# Altium schematic sheet 3V8_Power_Regulator.SchDoc: 3V8 Power Regulator
size 420 x 297 mm; SheetNumber: 3; SheetTotal: 9
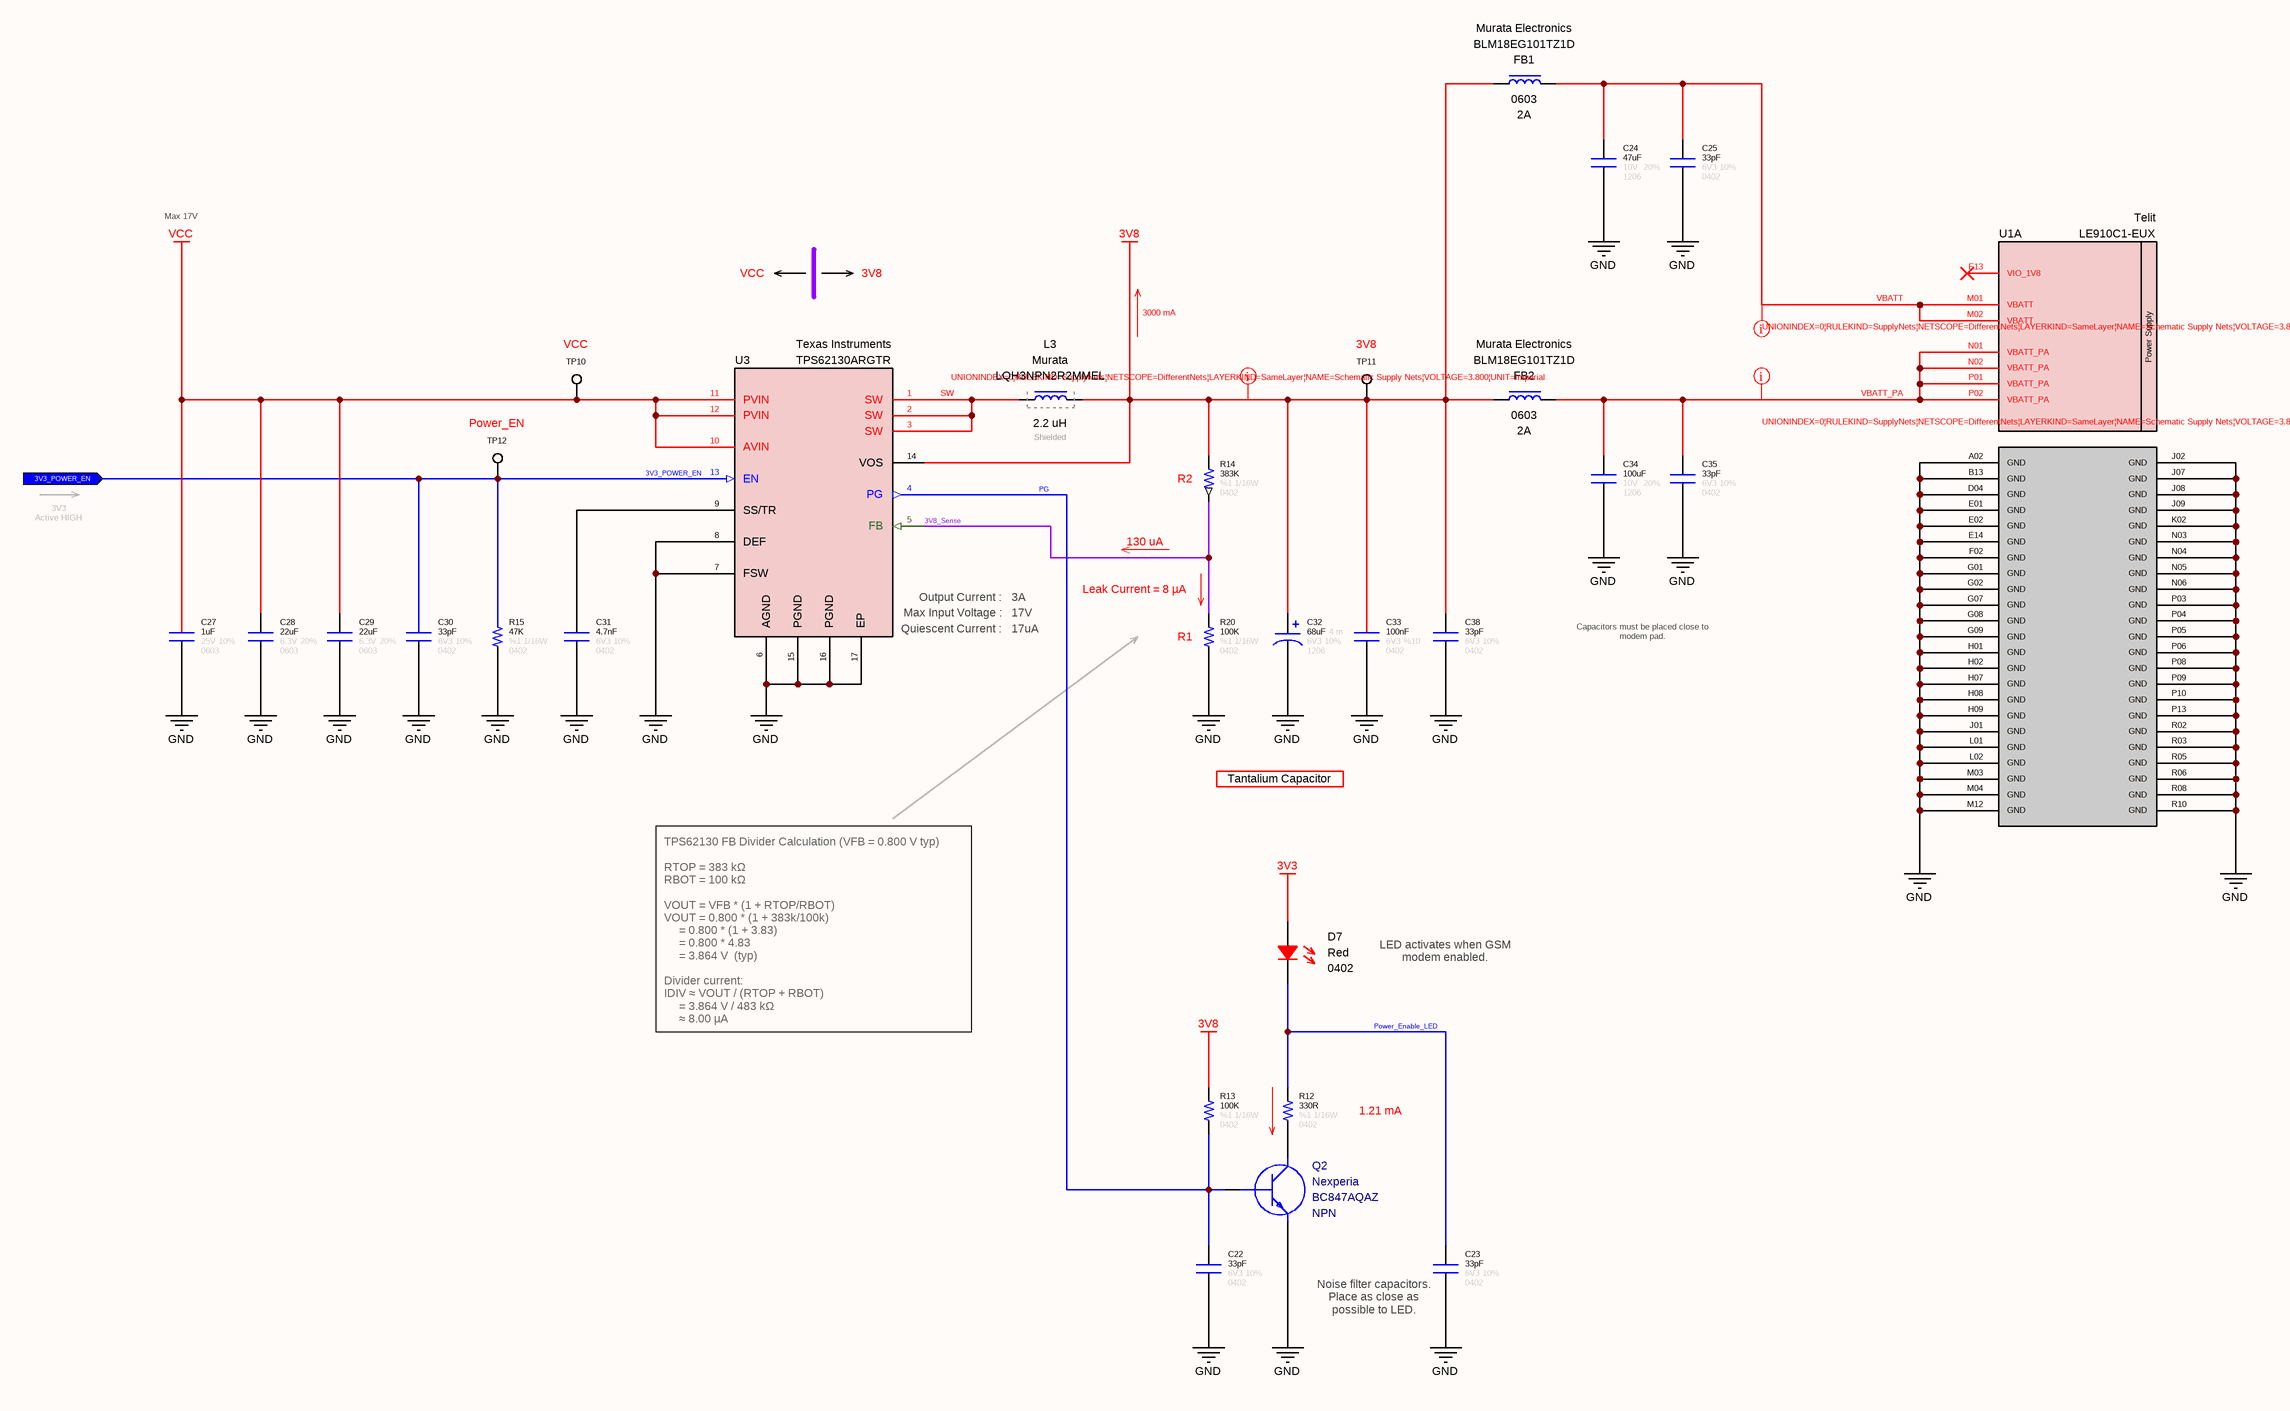
[diagram p0: 3V8_Power_Regulator.SchDoc]

## Parts
C22  value 33pF  Tolerance: 10%  Case: 0402  Voltage: 6V3  [CAPACITOR_0402]  (hidden comment: Capacitor - 33pF [0402] (Ceramic))
C23  value 33pF  Tolerance: 10%  Case: 0402  Voltage: 6V3  [CAPACITOR_0402]  (hidden comment: Capacitor - 33pF [0402] (Ceramic))
C24  value 47uF  Tolerance: 20%  Case: 1206  Voltage: 10V  [CAPACITOR_1206]  (hidden comment: Capacitor - 47uF [1206] (Ceramic))
C25  value 33pF  Tolerance: 10%  Case: 0402  Voltage: 6V3  [CAPACITOR_0402]  (hidden comment: Capacitor - 33pF [0402] (Ceramic))
C27  value 1uF  Tolerance: 10%  Case: 0603  Voltage: 25V  [CAPACITOR_0402]  (hidden comment: Capacitor - 1uF [0603] (Ceramic))
C28  value 22uF  Tolerance: 20%  Case: 0603  Voltage: 6.3V  [CAPACITOR_0603]  (hidden comment: Capacitor - 22uF [0603] (MLCC))
C29  value 22uF  Tolerance: 20%  Case: 0603  Voltage: 6.3V  [CAPACITOR_0603]  (hidden comment: Capacitor - 22uF [0603] (MLCC))
C30  value 33pF  Tolerance: 10%  Case: 0402  Voltage: 6V3  [CAPACITOR_0402]  (hidden comment: Capacitor - 33pF [0402] (Ceramic))
C31  value 4.7nF  Tolerance: 10%  Case: 0402  Voltage: 6V3  [CAPACITOR_0402]  (hidden comment: Capacitor - 4.7nF [0402] (MLCC))
C32  value 68uF  ESR: 4 m  Tolerance: 10%  Case: 1206  Voltage: 6V3  [CAPACITOR_1206 (Kemet)]  (hidden comment: Capacitor - 68uF [1206] (Tantalum))
C33  value 100nF  Tolerance: %10  Voltage: 6V3  Case: 0402  [CAPACITOR_0402]  (hidden comment: Capacitor - 100nF [0402] (Ceramic))
C34  value 100uF  Tolerance: 20%  Case: 1206  Voltage: 10V  [CAPACITOR_1206]  (hidden comment: Capacitor - 100uF [1206] (Ceramic))
C35  value 33pF  Tolerance: 10%  Case: 0402  Voltage: 6V3  [CAPACITOR_0402]  (hidden comment: Capacitor - 33pF [0402] (Ceramic))
C38  value 33pF  Tolerance: 10%  Case: 0402  Voltage: 6V3  [CAPACITOR_0402]  (hidden comment: Capacitor - 33pF [0402] (Ceramic))
D7  Case: 0402  Color: Red  [LED_0402]  (hidden comment: SMD LED (Red))
FB1  Maximum DC Current: 2A  Case: 0603  Manufacturer Part Number: BLM18EG101TZ1D  Manufacturer Name: Murata Electronics  [INDUCTOR_0603]  (hidden comment: Ferrite Bead)
FB2  Maximum DC Current: 2A  Case: 0603  Manufacturer Part Number: BLM18EG101TZ1D  Manufacturer Name: Murata Electronics  [INDUCTOR_0603]  (hidden comment: Ferrite Bead)
L3  value 2.2 uH  Manufacturer Name: Murata  Protection: Shielded  [LQH3NPN2R2MMEL]  (hidden comment: LQH3NPN2R2MMEL)
Q2  Manufacturer Name: Nexperia  Polarity: NPN  [SOT1215]  (hidden comment: BC847AQAZ)
R12  value 330R  Case: 0402  Tolerance: %1  Power: 1/16W  [RESISTOR_0402]  (hidden comment: 330R - 0402 - %1 - 1/16W)
R13  value 100K  Tolerance: %1  Case: 0402  Power: 1/16W  [RESISTOR_0402]  (hidden comment: 100K - 0402 - %1 - 1/16W)
R14  value 383K  Tolerance: %1  Case: 0402  Power: 1/16W  [RESISTOR_0402]  (hidden comment: 383K - 0402 - %1 - 1/16W)
R15  value 47K  Tolerance: %1  Case: 0402  Power: 1/16W  [RESISTOR_0402]  (hidden comment: 47K - 0402 - %1 - 1/16W)
R20  value 100K  Tolerance: %1  Case: 0402  Power: 1/16W  [RESISTOR_0402]  (hidden comment: 100K - 0402 - %1 - 1/16W)
TP10  VCC  [TP]  (no BOM)
TP11  3V8  [TP]  (no BOM)
TP12  Power_EN  [TP]  (no BOM)
U1  Manufacturer Part Number: LE910C1-EUX  Manufacturer Name: Telit  [LE910 GSM Modem]  (hidden comment: LE910C1-EUX LTE GSM Module)  (part A of 19)
U3  Manufacturer Name: Texas Instruments  Output Current: 3A  Input Voltage - Max: 17V  Quiescent Current: 17uA  [VQFN-EP-16]  (hidden comment: TPS62130ARGTR)

## Ports
3V3_POWER_EN (in)

## Nets
3V3: D7.2
3V8: C32.1 C33.2 C38.2 FB1.1 FB2.1 L3.2 R13.2 R14.2 TP11.1 U3.14(VOS)
GND: C22.1 C23.1 C24.1 C25.1 C27.1 C28.1 C29.1 C30.1 C31.1 C32.2 C33.1 C34.1 C35.1 C38.1 Q2.2(E) R15.1 R20.1 U1.A02(GND) U1.B13(GND) U1.D04(GND) U1.E01(GND) U1.E02(GND) U1.E14(GND) U1.F02(GND) U1.G01(GND) U1.G02(GND) U1.G07(GND) U1.G08(GND) U1.G09(GND) U1.H01(GND) U1.H02(GND) U1.H07(GND) U1.H08(GND) U1.H09(GND) U1.J01(GND) U1.J02(GND) U1.J07(GND) U1.J08(GND) U1.J09(GND) U1.K02(GND) U1.L01(GND) U1.L02(GND) U1.M03(GND) U1.M04(GND) U1.M12(GND) U1.N03(GND) U1.N04(GND) U1.N05(GND) U1.N06(GND) U1.P03(GND) U1.P04(GND) U1.P05(GND) U1.P06(GND) U1.P08(GND) U1.P09(GND) U1.P10(GND) U1.P13(GND) U1.R02(GND) U1.R03(GND) U1.R05(GND) U1.R06(GND) U1.R08(GND) U1.R10(GND) U3.6(AGND) U3.7(FSW) U3.8(DEF) U3.15(PGND) U3.16(PGND) U3.17(EP)
VCC: C27.2 C28.2 C29.2 TP10.1 U3.10(AVIN) U3.11(PVIN) U3.12(PVIN)
3V3_POWER_EN: C30.2 R15.2 TP12.1 U3.13(EN) ; port 3V3_POWER_EN
3V8_Sense: R14.1 R20.2 U3.5(FB)
PG: C22.2 Q2.1(B) R13.1 U3.4(PG)
Power_Enable_LED: C23.2 D7.1 R12.2
SW: L3.1 U3.1(SW) U3.2(SW) U3.3(SW)
VBATT: C24.2 C25.2 FB1.2 U1.M01(VBATT) U1.M02(VBATT)
VBATT_PA: C34.2 C35.2 FB2.2 U1.N01(VBATT_PA) U1.N02(VBATT_PA) U1.P01(VBATT_PA) U1.P02(VBATT_PA)
NetC31_2: C31.2 U3.9(SS/TR)
NetQ2_3: Q2.3(C) R12.1

Not connected (* = marked no-connect by the designer): U1 E13(VIO_1V8)*

## Layout directives
rule Supply Nets [Voltage = 3.800]: 3V8, VBATT, VBATT_PA

## Notes on the sheet
- Max 17V
- VCC
- 3V8
- 3000 mA
- (near R14) R2
- 3V3
  Active HIGH
- (near R20) Leak Current = 8 µA
- 130 uA
- (near R20) R1
- Capacitors must be placed close to modem pad.
- Tantalium Capacitor
- LED activates when GSM modem enabled.
- TPS62130 FB Divider Calculation (VFB = 0.800 V typ)
  RTOP = 383 kΩ
  RBOT = 100 kΩ
  VOUT = VFB * (1 + RTOP/RBOT)
  VOUT = 0.800 * (1 + 383k/100k)
  = 0.800 * (1 + 3.83)
  = 0.800 * 4.83
  = 3.864 V  (typ)
  Divider current:
  IDIV ≈ VOUT / (RTOP + RBOT)
  = 3.864 V / 483 kΩ
  ≈ 8.00 µA
- 1.21 mA
- (near C23) Noise filter capacitors. Place as close as possible to LED.
- © 2026 All rights reserved.
  This document may not, in whole or in part, be copied, photocopied, reproduced, translated or converted to any electronic or machine readable from without prior written permission of Mehmet Günce Akkoyun.
  Engineer contact : akkoyun@me.com
- Property of
- Engineer :
- Date :
- Size :
- A4
- Time :
- Project :
- Page :
- /
- Customer :
- Product ID :
- Module ID :
- Version :
- File :
- Revision :
- (in symbol IC - LE910C1-EUX, part A) Power Supply
- (in symbol IC - TPS62130) Output Current :; Max Input Voltage :; Quiescent Current :

## Library data of the parts
C22 C23 C25 C30 C35 C38 = Capacitor - 33pF [0402-6V3]: Manufacturer Name: Kemet; Manufacturer Part Number: C0402C330J9RACAUTO; ComponentLink1Description: DataSheet; ComponentLink1URL: https://api.kemet.com/component-edge/download/datasheet/C0402C330J9RACAUTO.pdf; ComponentLink2Description: Mouser; ComponentLink2URL: https://www.mouser.com/Search/Refine.aspx?Keyword=80-C0402C330J9RAUTO
C24 = Capacitor - 47uF [1206-10V]: Multilayer Ceramic Capacitors MLCC - SMD/SMT 47UF 10V 20% 1206; Manufacturer Part Number: C1206C476M8PAC; Manufacturer Name: Kemet
C27 = Capacitor - 1uF [0603-25V]: Multilayer Ceramic Capacitors - SMD - 25V 1uF X7R 0603 10%; Manufacturer Part Number: GCJ188R71E105KA01D; Manufacturer Name: Murata
C28 C29 = Capacitor - 22uF [0603-6V3]: Capacitor (MLCC) - 22uF / 6V3 / 0603; Manufacturer Part Number: GRM188R60J226MEA0D; Manufacturer Name: Murata Electronics; Subcategory: Capacitors; ComponentLink1Description: DataSheet; ComponentLink1URL: https://www.mouser.com.tr/datasheet/2/281/1/GRM188R60J226MEA0_01A-1985763.pdf; ComponentLink2Description: Mouser; ComponentLink2URL: https://www.mouser.com.tr/ProductDetail/Murata-Electronics/GRM188R60J226MEA0D?qs=p%2FZgMVRdWRkAKoLX3oNjgw%3D%3D
C31 = Capacitor - 4.7nF [0402-6V3]: Capacitor (MLCC) - 4.7nF / 6V3 / 0402; Manufacturer Name: KEMET; Manufacturer Part Number: C0402C472K9RACTU; Subcategory: Capacitors; ComponentLink1Description: DataSheet; ComponentLink1URL: https://www.mouser.com.tr/datasheet/2/447/KEM_C1002_X7R_SMD-3316098.pdf; ComponentLink2Description: Mouser; ComponentLink2URL: https://www.mouser.com.tr/ProductDetail/KEMET/C0402C472K9RACTU?qs=9uNKmdvpmtsLrzteMCrAvw%3D%3D
C32 = Capacitor - 68uF [1206-6V3]: Capacitor (Tantalum) - 68uF / 6V3 / 1206; Manufacturer Name: Kemet; Manufacturer Part Number: T491A686K006AT; ComponentLink1Description: DataSheet; ComponentLink1URL: https://www.mouser.com.tr/datasheet/2/315/AAA8000C36-944332.pdf; Subcategory: Capacitors; ComponentLink2Description: Mouser; ComponentLink2URL: https://www.mouser.com.tr/ProductDetail/Panasonic/10TPE68M?qs=OE1iw1LrrPG6aGLnsZkr4w%3D%3D
C33 = Capacitor - 100nF [0402-6V3]: Capacitor - 100nF [0402-6V3] (Ceramic); Manufacturer Name: AVX; Manufacturer Part Number: 04026D104KAT4A; ComponentLink1Description: Mouser; ComponentLink1URL: https://www.mouser.com.tr/ProductDetail/AVX/04026D104KAT4A?qs=sGAEpiMZZMs0AnBnWHyRQPg4iYkCw7IMED%2F4kpqgf7w%3D; ComponentLink2Description: DataSheet; ComponentLink2URL: https://www.mouser.com.tr/datasheet/2/40/cx5r-776519.pdf
C34 = Capacitor - 100uF [1206-10V]: Multilayer Ceramic Capacitors MLCC - SMD/SMT 100UF 10V 20% 1206; Manufacturer Part Number: GRM31CR61A107MEA8L; Manufacturer Name: Murata
D7 = Diode - LED (0402-Red): Standard LEDs - SMD MINI-MOLD ULTRA COMPACT RED; Manufacturer Name: ROHM Semiconductor; Manufacturer Part Number: SML-P12VTT86R; ROHS: Yes; ComponentLink1Description: DataSheet; ComponentLink1URL: https://www.mouser.com.tr/datasheet/2/348/sml-p1-e-1139198.pdf; ComponentLink2Description: Mouser; ComponentLink2URL: https://www.mouser.com.tr/ProductDetail/ROHM-Semiconductor/SML-P12U2TT86R?qs=sGAEpiMZZMseGfSY3csMkRIBDsfU3UCXJTULB5gem9Ta%252Bp%252BvZ709fg%3D%3D
FB1 FB2 = Inductor - Ferrite Bead [SMD]: Ferrite Beads 0603 100ohms 2000mA Auto Infotainment; Maximum DC Resistance: 45 mOhms; Tolerance: 25%; Value: BLM18EG101TZ1D; Height: 0.75mm; Maximum Operating Temperature: + 125; Minimum Operating Temperature: -55
L3 = Inductor - LQH3NPN2R2MMEL: 1.52 A. Power Inductors - SMD 4.7 UH 20%; Case: SMD; Manufacturer Part Number: LQH3NPN2R2MMEL
Q2 = Transistor - BC847: Bipolar NPN Transistors; Case: DFN-1010D-3; Manufacturer Part Number: BC847AQAZ
R12 = Resistor - 330R [0402]: Thick Film Resistors - SMD 1/16 W 330 Ohm 1%; Manufacturer Name: Vishay; Manufacturer Part Number: CRCW0402330RFKED; ComponentLink1Description: DataSheet; ComponentLink1URL: https://www.mouser.com.tr/datasheet/2/427/dcrcwe3-1762152.pdf; ComponentLink2Description: Mouser; ComponentLink2URL: https://www.mouser.com.tr/ProductDetail/Vishay-Dale/CRCW0402330RFKED?qs=sGAEpiMZZMu61qfTUdNhG2DpbjADlD3GGS6SwBlLi5Q%3D
R13 R20 = Resistor - 100K [0402]: Thick Film Resistors - SMD 1/16 W 100 KOhm 1%; Manufacturer Name: Vishay; Manufacturer Part Number: CRCW0402100KFKED; ComponentLink1Description: DataSheet; ComponentLink1URL: https://www.mouser.com.tr/datasheet/2/427/dcrcwe3-1762152.pdf; ComponentLink2Description: Mouser; ComponentLink2URL: https://www.mouser.com.tr/ProductDetail/Vishay-Dale/CRCW040210K0FKED?qs=sGAEpiMZZMu61qfTUdNhG2DpbjADlD3GcalbOv9utCY%3D
R14 = Resistor - 383K [0402]: Thick Film Resistors - SMD 1/16 W 383 KOhm 1%; Manufacturer Name: Vishay; Manufacturer Part Number: CRCW0402383KFKED
R15 = Resistor - 47K [0402]: Thick Film Resistors - SMD 1/16 W 47 KOhm 1%; Manufacturer Name: Vishay; Manufacturer Part Number: CRCW040247K0FKED; ComponentLink1Description: DataSheet; ComponentLink1URL: https://www.mouser.com.tr/datasheet/2/427/dcrcwe3-1762152.pdf; ComponentLink2Description: Mouser; ComponentLink2URL: https://www.mouser.com.tr/ProductDetail/Vishay-Dale/CRCW040247K0FKED?qs=sGAEpiMZZMu61qfTUdNhG2DpbjADlD3GL%252B3h1elTxqU%3D
TP10-TP12 = PCB - Test Point: Test Point
U1 = IC - LE910C1-EUX: Telit LE910C1-EUX LTE/2G GSM Module; Case: BGA
U3 = IC - TPS62130: Switching Voltage Regulators 3-17V 3A Step Down Converter.; Case: VQFN-EP-16; Manufacturer Part Number: TPS62130ARGTR